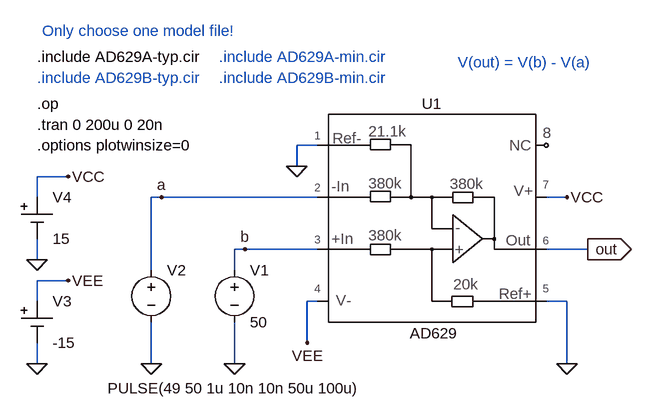
[diagram p0: schematic AD629_test.asc]
AD629_test.asc, the LTspice schematic file:
Version 4
SHEET 1 880 680
WIRE 48 128 16 128
WIRE 16 160 16 128
WIRE -336 176 -384 176
WIRE -384 208 -384 176
WIRE -192 208 -208 208
WIRE 48 208 -192 208
WIRE 432 208 400 208
WIRE -64 288 -80 288
WIRE 48 288 -64 288
WIRE 464 288 400 288
WIRE -384 304 -384 272
WIRE -208 320 -208 208
WIRE -80 320 -80 288
WIRE -336 336 -384 336
WIRE -384 368 -384 336
WIRE 48 368 32 368
WIRE 432 368 400 368
WIRE 32 432 32 368
WIRE -384 464 -384 432
WIRE -208 464 -208 400
WIRE -80 464 -80 400
WIRE 432 464 432 368
FLAG -80 464 0
FLAG -208 464 0
FLAG 432 464 0
FLAG -192 208 a
FLAG -64 288 b
FLAG 464 288 out
IOPIN 464 288 Out
FLAG 432 208 VCC
FLAG -384 464 0
FLAG -336 336 VEE
FLAG 32 432 VEE
FLAG -384 304 0
FLAG -336 176 VCC
FLAG 16 160 0
SYMBOL voltage -80 304 R0
SYMATTR InstName V1
SYMATTR Value 50
SYMBOL voltage -208 304 R0
WINDOW 3 -67 198 Left 0
WINDOW 123 0 0 Left 0
WINDOW 39 0 0 Left 0
SYMATTR Value PULSE(49 50 1u 10n 10n 50u 100u)
SYMATTR InstName V2
SYMBOL Misc\\cell -384 368 R0
SYMATTR InstName V3
SYMATTR Value -15
SYMBOL Misc\\cell -384 208 R0
SYMATTR InstName V4
SYMATTR Value 15
SYMBOL AD629 224 240 R0
SYMATTR InstName U1
TEXT -384 64 Left 0 !.op
TEXT 264 0 Left 0 ;V(out) = V(b) - V(a)
TEXT -384 96 Left 0 !.tran 0 200u 0 20n
TEXT -384 128 Left 0 !.options plotwinsize=0
TEXT -384 24 Left 0 ;.include AD629B-typ.cir
TEXT -104 -8 Left 0 ;.include AD629A-min.cir
TEXT -384 -8 Left 0 !.include AD629A-typ.cir
TEXT -104 24 Left 0 ;.include AD629B-min.cir
TEXT -376 -48 Left 0 ;Only choose one model file!

The netlist it stands for:
* AD629_test.asc
V1 b 0 50
V2 a 0 PULSE(49 50 1u 10n 10n 50u 100u)
V3 VEE 0 -15
V4 VCC 0 15
XU1 b a VCC VEE out 0 0 AD629  ; pins 3 2 7 4 6 1 5
.op
* V(out) = V(b) - V(a)
.tran 0 200u 0 20n
.options plotwinsize=0
* .include AD629B-typ.cir
* .include AD629A-min.cir
.include AD629A-typ.cir
* .include AD629B-min.cir
* Only choose one model file!
.backanno
.end